# Altium schematic sheet [2]IDC_Terminal.SchDoc: IDC&Terminal
size A4; Organization: Altium Limited; Address1: SPARC Lab; Address2: SEEE-HUST; Address3: Dai Co Viet, Ha Noi; DocumentNumber: 2; SheetNumber: 2; SheetTotal: 5
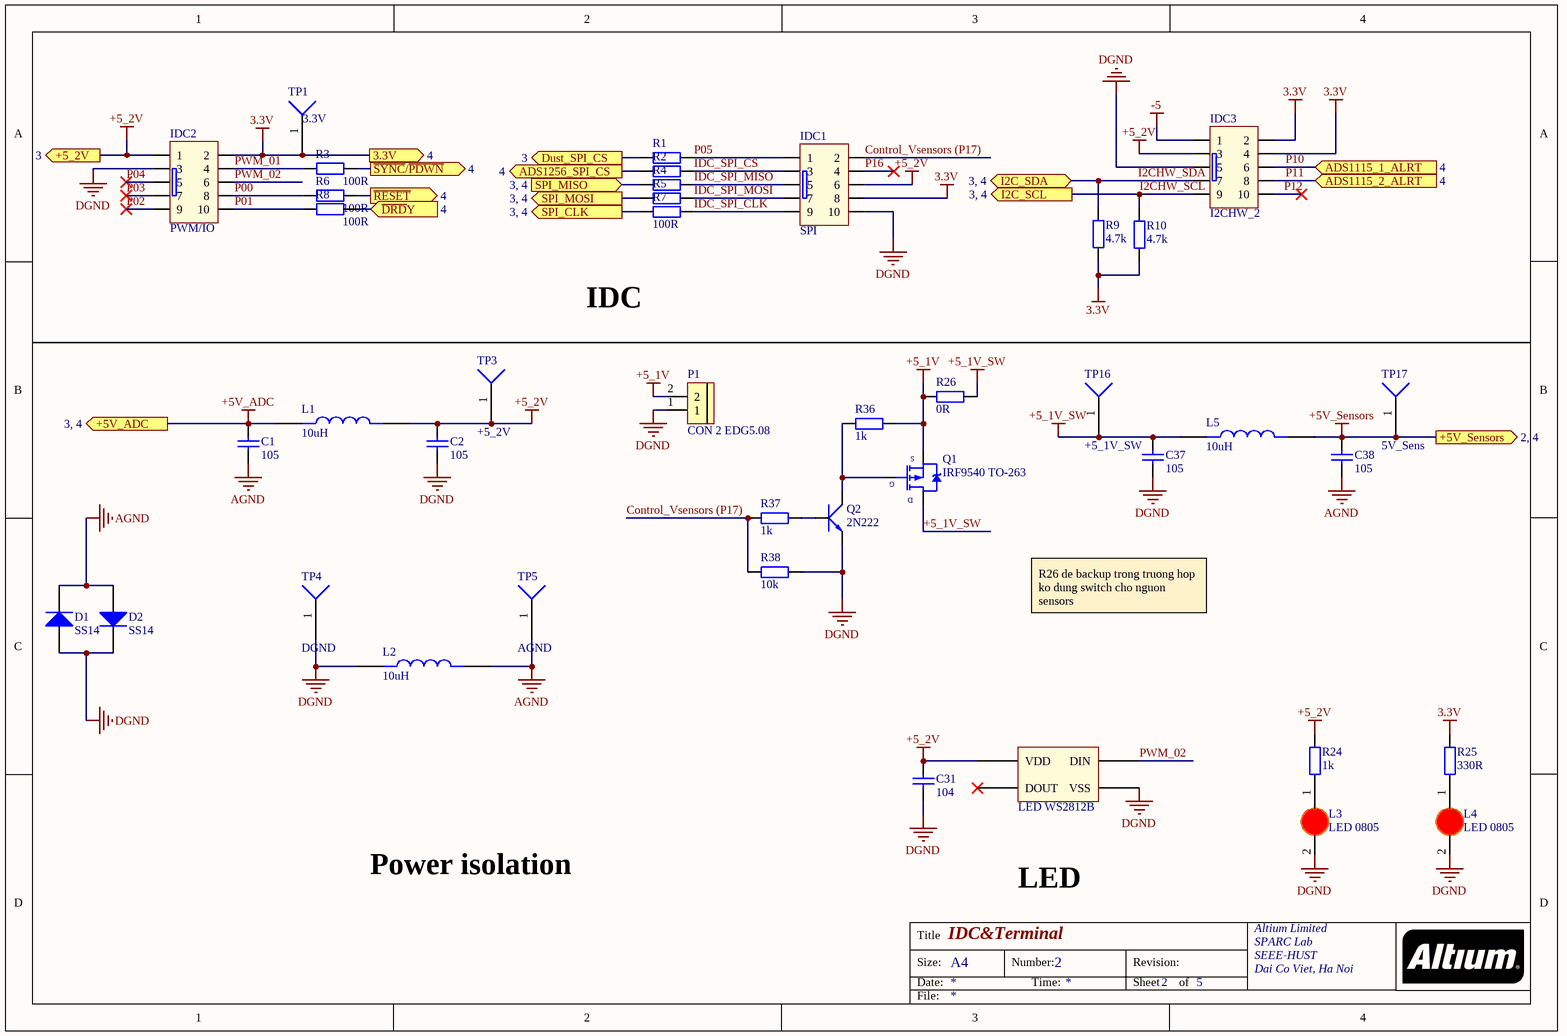
[diagram p0: [2]IDC_Terminal.SchDoc]

## Parts
C1  105  [tu 0805]
C2  105  [tu 0805]
C31  104  [tu 0805]
C37  105  [tu 0805]
C38  105  [tu 0805]
D1  SS14  [DIODE SMA]
D2  SS14  [DIODE SMA]
IDC1  SPI  [IDC10]
IDC2  PWM/IO  [IDC10]
IDC3  I2CHW_2  [IDC10]
L1  10uH  [Inductor 0805]
L2  10uH  [Inductor 0805]
L3  LED 0805  [LED-0805-Red]
L4  LED 0805  [LED-0805-Red]
L5  10uH  [Inductor 0805]
LED_WS2812B  LED WS2812B  [LED-WS2812B]
P1  CON 2 EDG5.08  [CON 2 2EDG5.08]
Q1  IRF9540 TO-263  [TO-263-3_MOSFET]
Q2  2N222  [SOT23-231]
R1  100R  [tro smd 0805]  (value not drawn)
R2  100R  [tro smd 0805]  (value not drawn)
R3  100R  [tro smd 0805]
R4  100R  [tro smd 0805]  (value not drawn)
R5  100R  [tro smd 0805]  (value not drawn)
R6  100R  [tro smd 0805]
R7  100R  [tro smd 0805]
R8  100R  [tro smd 0805]
R9  4.7k  [tro smd 0805]
R10  4.7k  [tro smd 0805]
R24  1k  [tro smd 0805]
R25  330R  [Tro SMD 0805]
R26  0R  [tro smd 1206]
R36  1k  [tro smd 0805]
R37  1k  [tro smd 0805]
R38  10k  [tro smd 0805]
TP1  3.3V  [pad_1.65x1.65_hole_1mm]
TP3  +5_2V  [pad_1.65x1.65_hole_1mm]
TP4  DGND  [pad_1.65x1.65_hole_1mm]
TP5  AGND  [pad_1.65x1.65_hole_1mm]
TP16  +5_1V_SW  [pad_1.65x1.65_hole_1mm]
TP17  5V_Sens  [pad_1.65x1.65_hole_1mm]

## Ports
3.3V (out, see 4), +5_2V (out, see 3), +5V_ADC (out, see 3, 4), +5V_Sensors (out, see 2, 4), ADS1115_1_ALRT (in, see 4), ADS1115_2_ALRT (in, see 4), ADS1256_SPI_CS (out, see 4), Dust_SPI_CS (out, see 3), I2C_SCL (out, see 3, 4), I2C_SDA (bidir, see 3, 4), SPI_CLK (out, see 3, 4), SPI_MISO (in, see 3, 4), SPI_MOSI (out, see 3, 4), ~{DRD}Y (in, see 4), ~{RESET} (out, see 4), ~{SYNC}/~{PDWN} (out, see 4)

## Nets
3.3V: IDC1.8 IDC2.2 IDC3.2 IDC3.4 R9.1 R10.1 R25.2 TP1.1 ; port 3.3V
+5_1V: P1.2 Q1.3(S) R26.1 R36.2
+5_1V_SW: C37.1 L5.2 Q1.2(D) R26.2 TP16.1
+5_2V: C2.1 C31.1 IDC1.6 IDC2.1 IDC3.3 L1.2 LED_WS2812B.1-VDD(VDD) R24.1 TP3.1 ; port +5_2V
+5V_ADC: C1.1 L1.1 ; port +5V_ADC
+5V_Sensors: C38.1 L5.1 TP17.1 ; port +5V_Sensors
-5: IDC3.1
AGND: C1.2 C38.2 D1.2(K) D2.1(A) L2.2 TP5.1
DGND: C2.2 C31.2 C37.2 D1.1(A) D2.2(K) IDC1.10 IDC2.3 IDC3.5 L2.1 L3.2(K) L4.2(K) LED_WS2812B.3-GND(VSS) P1.1 Q2.1(E) R38.2 TP4.1
ADS1256_SPI_CS: R2.1 ; port ADS1256_SPI_CS
Control_Vsensors (P17): IDC1.2 R37.1 R38.1
~{DRD}Y: R8.1 ; port ~{DRD}Y
Dust_SPI_CS: R1.1 ; port Dust_SPI_CS
I2CHW_SCL: IDC3.9 R10.2 ; port I2C_SCL
I2CHW_SDA: IDC3.7 R9.2 ; port I2C_SDA
IDC_SPI_CLK: IDC1.9 R7.2
IDC_SPI_CS: IDC1.3 R2.2
IDC_SPI_MISO: IDC1.5 R4.2
IDC_SPI_MOSI: IDC1.7 R5.2
P00: IDC2.8 R6.2
P01: IDC2.10 R8.2
P02: IDC2.9
P03: IDC2.7
P04: IDC2.5
P05: IDC1.1 R1.2
P10: IDC3.6 ; port ADS1115_1_ALRT
P11: IDC3.8 ; port ADS1115_2_ALRT
P12: IDC3.10
P16: IDC1.4
PWM_01: IDC2.4 R3.2
PWM_02: IDC2.6 LED_WS2812B.4-DIN(DIN)
~{RESET}: R6.1 ; port ~{RESET}
~{SYNC}/~{PDWN}: R3.1 ; port ~{SYNC}/~{PDWN}
SPI_CLK: R7.1 ; port SPI_CLK
SPI_MISO: R4.1 ; port SPI_MISO
SPI_MOSI: R5.1 ; port SPI_MOSI
NetL3_1: L3.1(A) R24.2
NetL4_1: L4.1(A) R25.1
NetQ1_1: Q1.1(G) Q2.3(C) R36.1
NetQ2_2: Q2.2(B) R37.2

Not connected (* = marked no-connect by the designer): LED_WS2812B 2-DOUT(DOUT)*

## Notes on the sheet
- IDC
- R26 de backup trong truong hop ko dung switch cho nguon sensors
- Power isolation
- LED
- Title
- Size:
- Date:
- A4
- Number:
- Time:
- Revision:
- Sheet
- of
- File:

## Library data of the parts
C1 C2 C37 C38 = Tu 0805 105 50V 10%: Dán; Don_Vi: Con; So_Chan: 2; Ten_Linh_Kien: Tụ 0805 105-1uF 10% 50V; Ma_Hang: MH004552; Chung_Loai: Dán; Kieu_Chan: *
C31 = Tu 0805 104 50V 10%: Dán; Don_Vi: Con; So_Chan: 2; Ten_Linh_Kien: Tụ 0805 104-100nF 10% 50V; Ma_Hang: MH004551; Chung_Loai: Dán; Kieu_Chan: *
D1 D2 = Diode SS14 ( 1N5819): Dán; Ma_Hang: MH002211; Don_Vi: Con; Ten_Linh_Kien: Diode SS14 DO214 Schottky 1A 40V ( 1N5819 DO214); Chung_Loai: Dán; Ghi_Chu: *; Kieu_Chan: *
IDC1-IDC3 = IDC 5X2: Value: Header 5x2
L1 L2 L5 = Cuon cam 0805: 1.5ÂµH Unshielded Multilayer Inductor 700mA 220mOhm 0805 (2012 Metric); MF: Laird; MP: CPI0805G1R5R-10; Value: *; Price: None; Package: 0805 Laird; Availability: Not in stock; Check_prices: https://www.snapeda.com/parts/CPI0805G1R5R-10/Laird/view-part/5881135/?ref=eda; SnapEDA_Link: https://www.snapeda.com/parts/CPI0805G1R5R-10/Laird/view-part/5881135/?ref=snap
L3 L4 = LED 0805 Do: Dán; Don_Vi: Con; Ma_Hang: MH000897; Ten_Linh_Kien: LED 0805 Màu Đỏ (Red); Ghi_Chu: *; Kieu_Chan: *; Chung_Loai: Dán
P1 = CON 2 EDG5.08: Cắm; Ten_Linh_Kien: CON 2 2EDG5.08-2P 5.08MM ( Xanh Cong); Ma_Hang: MH000759; Ghi_Chu: *; Don_Vi: Con; Kieu_Chan: *; Chung_Loai: Cắm
Q1 = IRF9540 SMD: P-Channel Power MOSFET; Note: Pin 2 is electrically connected to pin 4.; Published: 8-Jun-2000; LatestRevisionDate: 17-Jul-2002; LatestRevisionNote: Re-released for DXP Platform.; DatasheetVersion: PD-9.421C; PackageVersion: Feb-1997; PackageReference: TO-220AB; Publisher: Altium Limited; PackageDescription: TO, Thru-Hole, Vertical, Heatsink Mounted; 3 In-Line Leads; Pitch 2.54 mm; ComponentLink1Description: Manufacturer Link; ComponentLink1URL: http://www.irf.com/; ComponentLink2Description: Datasheet; ComponentLink2URL: http://www.irf.com/product-info/datasheets/data/irf9540.pdf
Q2 = 2N222: NPN 600mW, ECB; Value: C1815
R1-R8 = Tro 0805 5% 100R: Dán; Don_Vi: Con; So_Chan: 2; Ten_Linh_Kien: Trở 0805 5% 100R; Ma_Hang: MH005251; Chung_Loai: Dán; Kieu_Chan: *
R9 R10 = Tro 0805 5% 4.7k: Dán; Don_Vi: Con; So_Chan: 2; Ten_Linh_Kien: Trở 0805 5% 4.7k; Ma_Hang: MH005307; Chung_Loai: Dán; Kieu_Chan: *
R24 = Tro 0805 5% 1k: Dán; Don_Vi: Con; So_Chan: 2; Ten_Linh_Kien: Trở 0805 5% 1k; Ma_Hang: MH005234; Chung_Loai: Dán; Kieu_Chan: *
R25 = Tro 0805 5% 330R: Dán; Don_Vi: Con; So_Chan: 2; Ten_Linh_Kien: Trở 0805 5% 330R; Ma_Hang: MH005337; Chung_Loai: Dán; Kieu_Chan: *
R26 = Tro 1206 5% 0R: Dán; Don_Vi: Con; So_Chan: 2; Ten_Linh_Kien: Trở 1206 5% 0R; Ma_Hang: MH005902; Chung_Loai: Dán; Kieu_Chan: *
R36 R37 = Tro 0805 1% 1k: Dán; Don_Vi: Con; So_Chan: 2; Ten_Linh_Kien: Trở 0805 1% 1k; Ma_Hang: MH005468; Chung_Loai: Dán; Kieu_Chan: *
R38 = Tro 0805 1% 10k: Dán; Don_Vi: Con; So_Chan: 2; Ten_Linh_Kien: Trở 0805 1% 10k; Ma_Hang: MH005473; Chung_Loai: Dán; Kieu_Chan: *
TP1 TP3-TP5 TP16 TP17 = Test Point: Ports: 1; Positions/Loaded: Port1 - 4/2; PerformanceCategory: 3; PCB_Mounting: Thru-Hole; PCB_Thickness: 0.125"; DrillSize: Nominal, Rounded to nearest 0.05mm; PCB_Layout: Complies with Manufacturer's Recommendation.; Published: 25-Jun-2002; DatasheetDocument: 20-Nov-2001; PackageDocument: 20-Nov-2001; PackageReference: 42878-4410; Publisher: Altium Limited; ComponentLink1Description: Manufacturer Link; ComponentLink1URL: http://www.molex.com/; ComponentLink2Description: Datasheet; ComponentLink2URL: http://www.molex.com/cmc_upload/common_files/1212003_42878catalogpage.pdf